# EAGLE design FRA_Sensor_TGS2xxx (EAGLE 7.6.0)
CNAME: Sensor board TGS2xxxx; CREVISION: 01
Assembly variants: TGS26xx, TGS2444, CO2
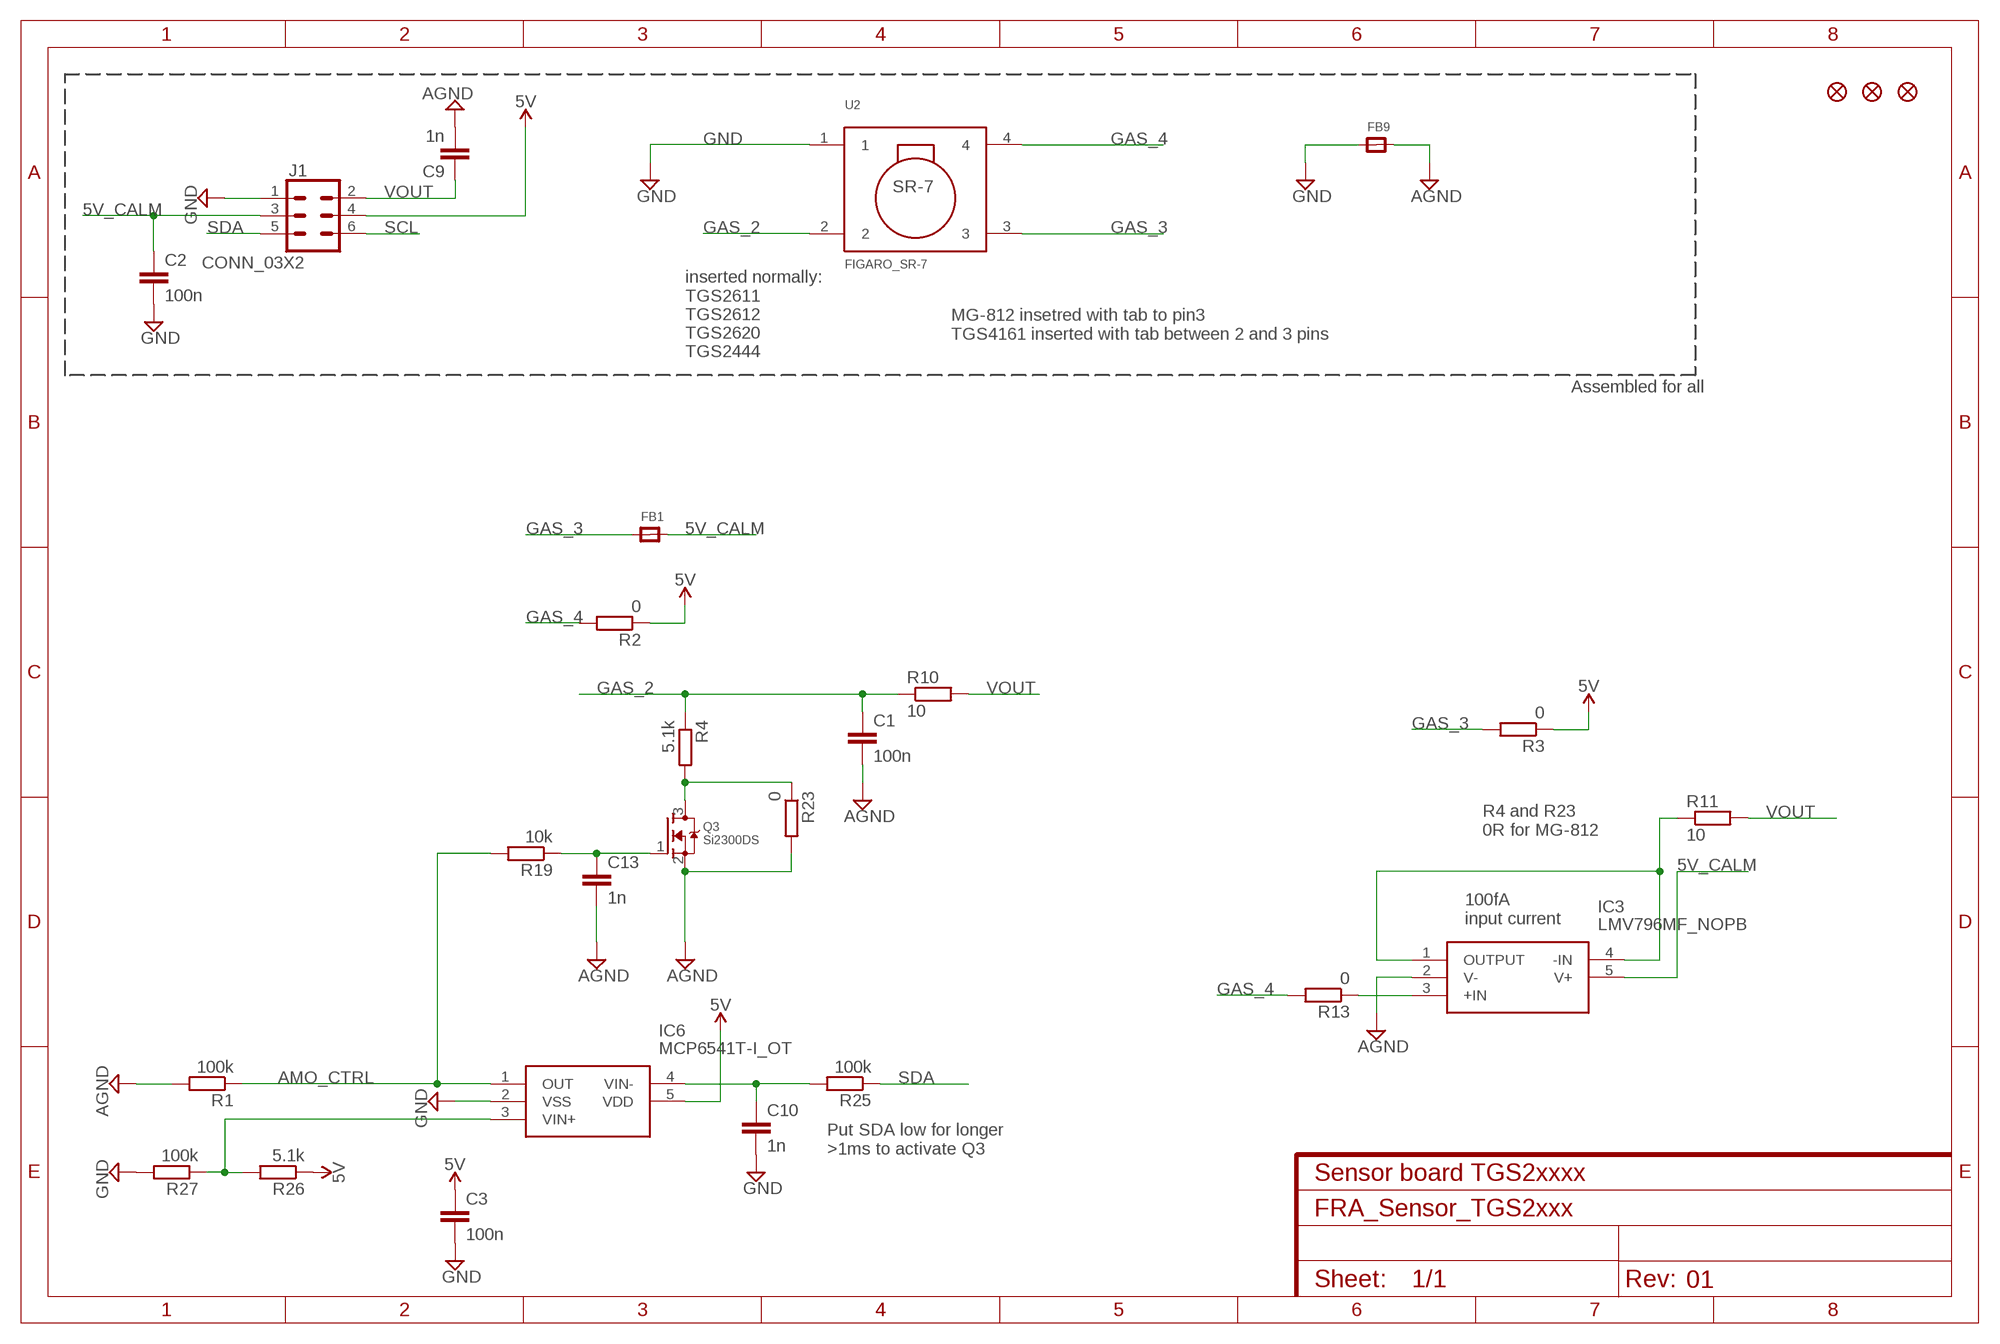
[diagram p0: schematic, sheet 1]

## Parts
C1  100n  C-EUC0603K  [C0603K]  (not fitted in variant TGS2444)  (not fitted in variant CO2)
C2  100n  C-EUC0603K  [C0603K]
C3  100n  C-EUC0603K  [C0603K]  (not fitted in variant TGS26xx)
C9  1n  C-EUC0603K  [C0603K]  (not fitted in variant TGS26xx)  (variant CO2: 100n)
C10  1n  C-EUC0603K  [C0603K]  (not fitted in variant TGS26xx)  (not fitted in variant CO2)
C13  1n  C-EUC0603K  [C0603K]  (not fitted in variant TGS26xx)  (not fitted in variant CO2)
FB1  FERRITE  [0603]  (not fitted in variant CO2)
FB9  FERRITE  [0603]
FID1  FIDUCIAL""  [FIDUCIAL_1MM]
FID2  FIDUCIAL""  [FIDUCIAL_1MM]
FID4  FIDUCIAL""  [FIDUCIAL_1MM]
IC3  LMV796MF_NOPB  [SOT95P280X145-5N]  (not fitted in variant TGS26xx)  (not fitted in variant TGS2444)
IC6  MCP6541T-I_OT  [SOT95P270X145-5N]  (not fitted in variant TGS26xx)  (not fitted in variant CO2)
J1  CONN_03X2  CONN_03X2_WE_61200621621  [WE_61200621621]
Q3  Si2300DS  MOSFET-NREFLOW  [SOT23]  (not fitted in variant TGS26xx)  (not fitted in variant CO2)
R1  100k  R-EU_R0603  [R0603]  (not fitted in variant TGS26xx)  (not fitted in variant CO2)
R2  0  R-EU_R0603  [R0603]  (not fitted in variant CO2)
R3  0  R-EU_R0603  [R0603]  (not fitted in variant TGS26xx)  (not fitted in variant TGS2444)
R4  5.1k  R-EU_R0603  [R0603]  (variant CO2: 0)
R10  10  R-EU_R0603  [R0603]  (not fitted in variant CO2)
R11  10  R-EU_R0603  [R0603]  (not fitted in variant TGS26xx)  (not fitted in variant TGS2444)
R13  0  R-EU_R0603  [R0603]  (not fitted in variant TGS26xx)  (not fitted in variant TGS2444)
R19  10k  R-EU_R0603  [R0603]  (not fitted in variant TGS26xx)
R23  0  R-EU_R0603  [R0603]  (not fitted in variant TGS2444)
R25  100k  R-EU_R0603  [R0603]  (not fitted in variant TGS26xx)  (not fitted in variant CO2)
R26  5.1k  R-EU_R0603  [R0603]  (not fitted in variant TGS26xx)  (not fitted in variant CO2)
R27  100k  R-EU_R0603  [R0603]  (not fitted in variant TGS26xx)  (not fitted in variant CO2)
U2  FIGARO_SR-7  [FIGARO-SR7]

## Nets
5V: C3.1 IC6.5(VDD) J1.4 R2.1 R3.1 R26.1
5V_CALM: C2.1 FB1.2 IC3.5(V+) J1.3
AGND: C1.2 C9.2 C13.2 FB9.2 IC3.2(V-) Q3.2(S) R1.2 R23.2
AMO_CTRL: IC6.1(OUT) R1.1 R19.2
GAS_2: C1.1 R4.1 R10.1 U2.2
GAS_3: FB1.1 R3.2 U2.3
GAS_4: R2.2 R13.2 U2.4
GND: C2.2 C3.2 C10.2 FB9.1 IC6.2(VSS) J1.1 R27.2 U2.1
N$7: IC3.1(OUTPUT) IC3.4(-IN) R11.1
N$8: C13.1 Q3.1(G) R19.1
N$10: IC3.3(+IN) R13.1
N$15: Q3.3(D) R4.2 R23.1
N$21: C10.1 IC6.4(VIN-) R25.2
N$23: IC6.3(VIN+) R26.2 R27.1
SCL: J1.6
SDA: J1.5 R25.1
VOUT: C9.1 J1.2 R10.2 R11.2

## Notes on the sheet
- MG-812 insetred with tab to pin3
  TGS4161 inserted with tab between 2 and 3 pins
- inserted normally:
  TGS2611
  TGS2612
  TGS2620
  TGS2444
- Assembled for all
- R4 and R23
  0R for MG-812
- 100fA
  input current
- Put SDA low for longer
  >1ms to activate Q3

## Library data of the parts
C1-C3 = resistor:C-EU: CAPACITOR, European symbol; PARTNO: GRM188R71C104KA01D
C9 C10 C13 = resistor:C-EU: CAPACITOR, European symbol; PARTNO: GRM188R71H102KA01D
FB1 FB9 = microbuilder:FERRITE: Ferrite Bead 0603 MMZ1608B121C - 120 Ohm @ 100MHz, 600mA, 0.15 Ohm DC Resistance - Digikey: 445-2164-1-ND BK1608HW121-T - 120 Ohm, 600mA Ferrite Chip - Digikey: 587-1876-2-ND 0805 HZ0805B272R-10 - 2.7K Ohm @ 100MHz, 200mA, 0.8 Ohm DC Resistance - Digikey: 240-2504-1-ND (see also Murata BLM21BD272SN1L) MMZ2012Y152B - 1.5K Ohm @ 100MHz, 500mA, 0.4 Ohm DC Resistance - Digikey: 445-1560-1-ND - Mainly for high frequency (80-400MHz) MMZ2012R102A - 1K Ohm @ 100MHz, 500mA, 0.3 Ohm DC Resistance - Digikey: 445-1555-2-ND - More general purpose (10-200MHz); PARTNO: BLM18PG121SN1D
FID1 FID2 FID4 = microbuilder:FIDUCIAL: Fiducial Alignment Points Various fiducial points for machine vision alignment.
IC3 = SamacSys_Parts:LMV796MF_NOPB: Single 17 MHz, low noise, CMOS input, 1.8V operational amplifier Source: Datasheet <http://www.ti.com/lit/ds/symlink/lmv796.pdf>; DESCRIPTION: Single 17 MHz, low noise, CMOS input, 1.8V operational amplifier; HEIGHT: 1.45mm; MANUFACTURER_NAME: Texas Instruments; MANUFACTURER_PART_NUMBER: LMV796MF/NOPB; MOUSER_PART_NUMBER: 926-LMV796MF/NOPB; MOUSER_PRICE-STOCK: https://www.mouser.com/Search/Refine.aspx?Keyword=926-LMV796MF%2FNOPB; PARTNO: LMV796MF
IC6 = SamacSys_Parts:MCP6541T-I_OT: Comparator Push-Pull RRIO 1.6V SOT23-5 Source: Datasheet <https://componentsearchengine.com/Datasheets/1/MCP6541T-I_OT.pdf>; DESCRIPTION: Comparator Push-Pull RRIO 1.6V SOT23-5; HEIGHT: 1.45mm; MANUFACTURER_NAME: Microchip; MANUFACTURER_PART_NUMBER: MCP6541T-I/OT; MOUSER_PART_NUMBER: 579-MCP6541T-I/OT; MOUSER_PRICE-STOCK: https://www.mouser.com/Search/Refine.aspx?Keyword=579-MCP6541T-I%2FOT; PARTNO: MCP6541T-I/OT
J1 = FRA_eagle_lib:CONN_03X2_WE_61200621621: https://eu.mouser.com/ProductDetail/Wurth-Elektronik/61200621621?qs=sGAEpiMZZMs%252BGHln7q6pm%2FFhW%252BtWvhAgbNxkR%252BlwXp8Ip%2FAN9J9VOg%3D%3D https://eu.mouser.com/datasheet/2/445/6120xx21621-265830.pdf; PARTNO: 30306-6002HB
Q3 = adafruit:MOSFET-N: N-Channel Mosfet 2N7002E - 60V 260mA SOT23 [Digikey: 2N7002ET1GOSTR-ND] - REEL BSH103 - 30V 850mA SOT23 [Digikey: 568-5013-1-ND]; PARTNO: SI2300DS-T1-GE3
R1 R25 R27 = resistor:R-EU_: RESISTOR, European symbol; PARTNO: CRCW0603100KFKEA
R2 R3 R13 R23 = resistor:R-EU_: RESISTOR, European symbol; PARTNO: CRCW06030000Z0EA
R4 R26 = resistor:R-EU_: RESISTOR, European symbol; PARTNO: CRCW06035K10FKEA
R10 R11 = resistor:R-EU_: RESISTOR, European symbol; PARTNO: CRCW060310R0FKEA
R19 = resistor:R-EU_: RESISTOR, European symbol; PARTNO: CRCW060310K0FKEA
U2 = FRA_eagle_lib:FIGARO_SR-7; PARTNO: installed_by_customer

## Board
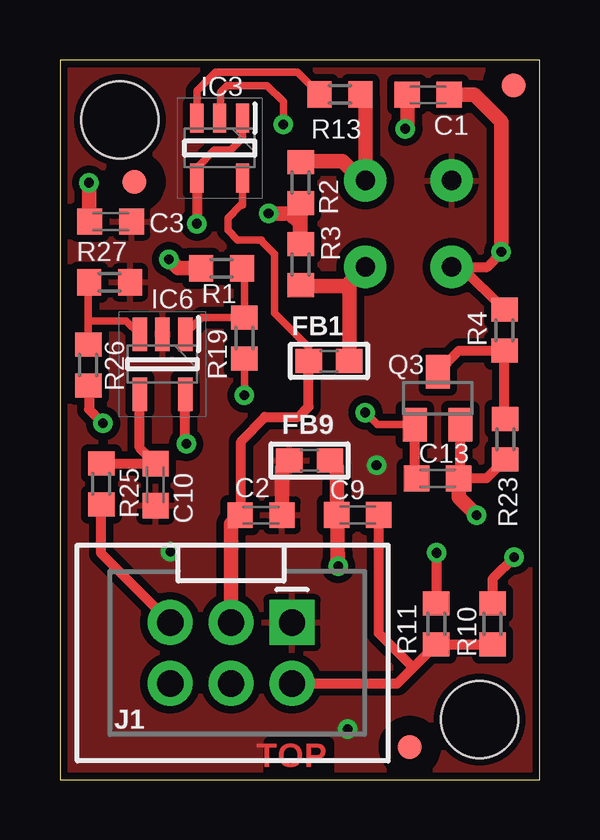
[diagram p1: board, top side]
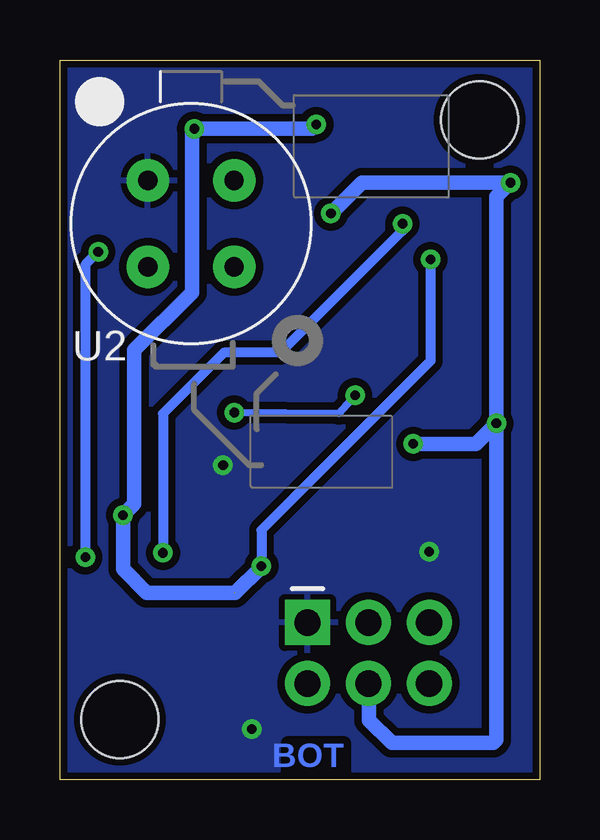
[diagram p2: board, bottom side, seen from below]

Size 20 x 30 mm. Coordinates in mm from the lower left corner, seen from the top.
Outline: 0,0 20,0 20,30 0,30 0,0
Copper layers (1*16): Top 0.035mm / dielectric 1.6mm / Bottom 0.035mm
Design rules "AllPCB": minimum track width 6mil, minimum drill 0.399mm, track to track 0.149859375mm, track to pad 0.149859375mm, pad to pad 8mil, via to via 17mil, smd to smd 6mil, copper to edge 10mil, drill to drill 24mil, minimum pad ring 10mil, minimum via ring 8mil, stop-mask expansion 4mil, vias tented up to drill 0.3mm, thermal gap 10mil
Holes 3.2 mm at 2.5,27.5 17.5,2.5

### Footprints (pad centres in the part's own frame; a part is rotated, then mirrored left to right if it is on the bottom)
C0603K = smd 1.05 x 1.08: 1 -0.875,0; 2 0.875,0
0603 = smd 1.1 x 1: 1 -0.85,0; 2 0.85,0
FIDUCIAL_1MM = smd 1 x 1: 1 0,0
SOT95P280X145-5N = smd 1.2 x 0.55: 1 -1.25,0.95; 2 -1.25,0; 3 -1.25,-0.95; 4 1.25,-0.95; 5 1.25,0.95
SOT95P270X145-5N = smd 1.4 x 0.6: 1 -1.25,0.95; 2 -1.25,0; 3 -1.25,-0.95; 4 1.25,-0.95; 5 1.25,0.95
WE_61200621621 = drill 1.1 pad 1.88 square: 1 -1.27,2.54 | drill 1.1 pad 1.88: 2 1.27,2.54; 3 -1.27,0; 4 1.27,0; 5 -1.27,-2.54; 6 1.27,-2.54
SOT23 = smd 1 x 1.4: 1 -0.95,-1.1; 2 0.95,-1.1; 3 0,1.1
R0603 = smd 1 x 1.1: 1 -0.85,0; 2 0.85,0
FIGARO-SR7 = drill 0.8 pad 1.778: 1 -1.8,1.8; 2 -1.8,-1.8; 3 1.8,-1.8; 4 1.8,1.8

### Placement (x,y rotation side)
C1  15.36,28.54 180 top  (not fitted)
C2  8.38,11.02 0 top
C3  2.12,23.27 0 top
C9  12.42,11.03 180 top
C10  3.98,12.29 270 top
C13  15.75,12.55 0 top
DRILEGEND  [DRILEGEND]  -0.74,-8.14 0 top  (outside the outline)
FB1  11.22,17.45 180 top
FB9  10.41,13.3 0 top
FID1  14.59,1.35 0 top
FID2  3.11,24.92 0 top
FID4  18.93,28.94 0 top
IC3  6.66,26.33 270 top  (not fitted)
IC6  4.28,17.32 270 top
J1  7.14,5.28 270 top
Q3  15.75,15.89 0 top
R1  6.74,21.31 180 top
R2  10.04,24.89 90 top
R3  10.04,21.46 270 top  (not fitted)
R4  18.54,18.73 270 top
R10  18.04,6.49 270 top
R11  15.69,6.49 270 top  (not fitted)
R13  11.68,28.56 0 top  (not fitted)
R19  7.7,18.41 90 top
R23  18.57,14.19 270 top  (not fitted)
R25  1.72,12.33 90 top
R26  1.18,17.29 90 top
R27  2.08,20.73 0 top
U2  14.54,23.18 0 bottom

### Tracks (layer width: path | path; a pad name or v marks a point on that pad's centre or on a via)
5V  (via drill 0.4 pad 0.81)
  Top 0.406: R26.1 1.22,16.4 1.22,15.44 v1.8,14.85 | v5.26,13.99 5.23,14.03 IC6.5
  Top 0.61: C3.1 1.22,23.29 v1.22,24.89 | R2.1 R3.1 10,22.35 10,23.2 9.6,23.6 v8.7,23.6
  Bottom 0.61: v1.8,14.85 2.65,13.99 v5.26,13.99 | J1.4 7.11,3.98 7.11,2.48 6.17,1.53 1.94,1.53 1.8,1.67 v1.8,14.85 | v1.8,14.85 1.8,24.3 v1.22,24.89 7.42,24.89 v8.7,23.6
5V_CALM
  Top 0.305: FB1.2 10.37,18.02 8.96,19.44 8.96,21.9 8.4,22.45 8.4,22.5 7.4,22.5 7,22.9 7,23.4 7.54,23.94 7.61,23.94 IC3.5
  Top 0.406: C2.1 7.56,11.07 7.56,14.09 8.55,15.12 9.95,15.12 10.37,15.54 FB1.2
  Top 0.61: C2.1 7.14,10.65 J1.3
AGND  (via drill 0.4 pad 0.81)  (1 unrouted)
  Top 0.254: FB9.2 11.6,12.96 11.6,9.4
  Top 0.305: IC3.2 6.71,27.62 6.71,28.66 6.97,28.93 8.64,28.93 9.31,28.26 v9.31,27.32
  Top 0.406: Q3.2 16.7,12.63 C13.2 17.79,12.55 R23.2
  Top 0.61: FB9.2 11.54,13.02 C9.2 11.56,11.01 11.56,8.91 | C13.2 16.62,11.77 v17.37,11.03 | R1.2 4.92,21.31 v4.54,21.69 | 14.4,28.46 C1.2 14.48,27.21 v14.4,27.14 | v11.6,8.9 11.6,9.4
  Bottom 0.254: 12.7,7.8 16.3,7.8 17.3,8.8 17.4,8.8 17.4,11
  Bottom 0.406: v4.54,21.69 4.54,17.45 11.6,10.4 v11.6,8.9
  Bottom 0.61: v17.37,11.03 17.37,8.78 16.38,7.79 12.69,7.79 11.6,8.88 v11.6,8.9 | 17.4,11 16.9,11.5 16.9,17.9 14.5,20.3 14.5,27.04 v14.4,27.14 9.49,27.14 v9.31,27.32
AMO_CTRL
  Top 0.305: IC6.1 5.92,19.25 R19.2 7.7,21.21 R1.1
GAS_2  (via drill 0.4 pad 0.81)
  Top 0.406: R4.1 16.74,21.38 U2.2 17.82,21.38 18.41,21.96 v18.41,22 | v18.95,9.27 18.04,8.36 R10.1
  Top 0.61: C1.1 17.29,28.54 18.41,27.43 v18.41,22
  Bottom 0.406: v18.41,22 18.95,21.46 v18.95,9.27
GAS_3
  Top 0.61: U2.3 12.07,20.71 12.07,20.57 | 12.07,20.57 FB1.1 | R3.2 10.09,20.57 12.07,20.57
GAS_4
  Top 0.61: R13.2 12.73,28.36 U2.4 12.6,24.98 11.79,25.79 10.09,25.79 R2.2
GND  (via drill 0.4 pad 0.81)
  Top 0.61: C2.2 9.26,13 FB9.1
  other vias: 4.6,9.5 13.2,13.1 12,2.1
  pour Top (isolate 0.305): 0,30 20,30 20,0 0,0
  pour Bottom (isolate 0.305): 0,30 20,30 20,0 0,0
N$7  (via drill 0.4 pad 0.81)
  Top 0.305: IC3.4 5.71,25.51 6.43,26.23 7.11,26.23 7.61,26.73 IC3.1
  Top 0.406: IC3.4 v5.71,23.18 | v15.71,9.45 15.71,7.35 R11.1
  Bottom 0.406: v15.71,9.45 15.71,15.26 13.16,17.8 10.8,17.8 5.71,22.89 v5.71,23.18
N$8  (via drill 0.4 pad 0.81)
  Top 0.305: R19.1 v7.7,16.02 | v12.73,15.3 13.24,14.79 Q3.1
  Top 0.406: C13.1 14.8,12.63 Q3.1
  Bottom 0.305: v7.7,16.02 8.37,15.26 v12.73,15.3
N$10
  Top 0.305: IC3.3 5.71,28.71 6.5,29.49 9.9,29.49 R13.1
N$15
  Top 0.406: R23.1 18.54,15.07 R4.2 16.64,17.88 Q3.3
N$21
  Top 0.406: R25.2 1.74,13.17 C10.1 3.33,13.82 IC6.4
N$23
  Top 0.305: R27.1 1.18,20.69 1.18,19.12 | 1.18,19.12 R26.2 | IC6.3 2.77,19.12 1.18,19.12
SDA
  Top 0.406: J1.5 1.72,9.42 R25.1
VOUT
  Top 0.406: J1.2 14.06,4.01 R11.2 | R11.2 R10.2 | R11.2 14.74,4.68 14.71,4.68 13.29,6.1 C9.1

### Text on the board
Top: TOP
Bottom: BOT
bDocu: TGS26.. / 11,12,20 / TGS2444 | MG-812 / TGS4161 | TGS_PCB_V1 | J.Repcik / 8/19